# Altium project MainFileProject.PrjPcb
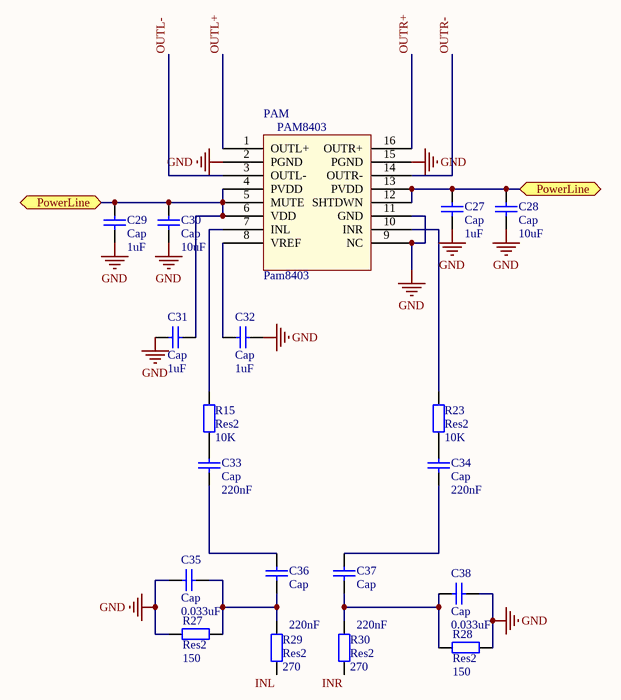
[diagram p0: Audio_Actual.SchDoc]
4 sheets, 123 parts. Net scope: flat (ports and power ports of the same name join across sheets).
Board file: DMG_Control_PanelV2.PcbDoc
Sheets:
  Audio_Actual.SchDoc
  ArduinoLeonard.SchDoc
  PowerBoost_Adafruit_based.SchDoc
  USBHUB.SchDoc

## Sheet Audio_Actual.SchDoc
size A4; PageSetup: Record=PageOptions|CenterHorizontal=True|CenterVertical=True|PrintScale=0.97|XCorrection=1.00|YCorrection=1.00|PrintKind=0|BorderSize=5000000|LeftOffset=0|BottomOffset=0|Orientation=2|PaperLength=1000|PaperWidth=1000|Scale=100|PaperSource=7|PrintQuality=-3|MediaType=1|DitherType=10|PrintScaleMode=1|PaperKind=A4|PaperIndex=9

### Parts
C27  Cap  value 1uF  [0805]
C28  Cap  value 10uF  [0805]
C29  Cap  value 1uF  [0805]
C30  Cap  value 10uF  [0805]
C31  Cap  value 1uF  [0805]
C32  Cap  value 1uF  [0805]
C33  Cap  value 220nF  [0805]
C34  Cap  value 220nF  [0805]
C35  Cap  value 0.033uF  [0805]
C36  Cap  value 220nF  [RES-1206in]
C37  Cap  value 220nF  [RES-1206in]
C38  Cap  value 0.033uF  [0805]
PAM  Pam8403  [pam8403 Sop16]
R15  Res2  value 10K  [0805]
R23  Res2  value 10K  [0805]
R27  Res2  value 150  [0805]
R28  Res2  value 150  [0805]
R29  Res2  value 270  [0805]
R30  Res2  value 270  [0805]

### Ports
PowerLine

### Nets
GND: C27.2 C28.1 C29.2 C30.1 C31.1 C32.2 C35.2 C38.1 PAM.2(PGND) PAM.9(NC) PAM.11(GND) PAM.15(PGND) R27.2 R28.1
INL: R29.1
INR: R30.1
OUTL+: PAM.1(OUTL+)
OUTL-: PAM.3(OUTL-)
OUTR+: PAM.16(OUTR+)
OUTR-: PAM.14(OUTR-)
Net5V_2: C27.1 C28.2 C29.1 C30.2 C31.2 PAM.4(PVDD) PAM.5(MUTE) PAM.6(VDD) PAM.12(SHTDWN) PAM.13(PVDD) ; port PowerLine
NetC32_1: C32.1 PAM.8(VREF)
NetC33_1: C33.1 C36.2
NetC33_2: C33.2 R15.1
NetC34_1: C34.1 C37.2
NetC34_2: C34.2 R23.1
NetC35_1: C35.1 C36.1 R27.1 R29.2
NetC37_1: C37.1 C38.2 R28.2 R30.2
NetPAM_7: PAM.7(INL) R15.2
NetPAM_10: PAM.10(INR) R23.2

### Notes on the sheet
- (in symbol Pam8403) PAM8403

### Library data of the parts
C27-C38 = Cap: Capacitor; Published: 8-Jun-2000; LatestRevisionDate: 17-Jul-2002; LatestRevisionNote: Re-released for DXP Platform.; PackageReference: RAD-0.3; Publisher: Altium Limited; PackageDescription: Radial Cap, Thru-Hole; 2 Leads; 0.3 in Pin Spacing
R15 R23 R27-R30 = Res2: Resistor; Published: 8-Jun-2000; LatestRevisionDate: 17-Jul-2002; LatestRevisionNote: Re-released for DXP Platform.; PackageReference: AXIAL-0.4; Publisher: Altium Limited; PackageDescription: Axial Device, Thru-Hole; 2 Leads; 0.4 in Pin Spacing

## Sheet ArduinoLeonard.SchDoc
size A4; PageSetup: Record=PageOptions|CenterHorizontal=True|CenterVertical=True|PrintScale=0.97|XCorrection=1.00|YCorrection=1.00|PrintKind=0|BorderSize=5000000|LeftOffset=0|BottomOffset=0|Orientation=2|PaperLength=1000|PaperWidth=1000|Scale=100|PaperSource=278|PrintQuality=-3|MediaType=1|DitherType=10|PrintScaleMode=1|PaperKind=A4|PaperIndex=9
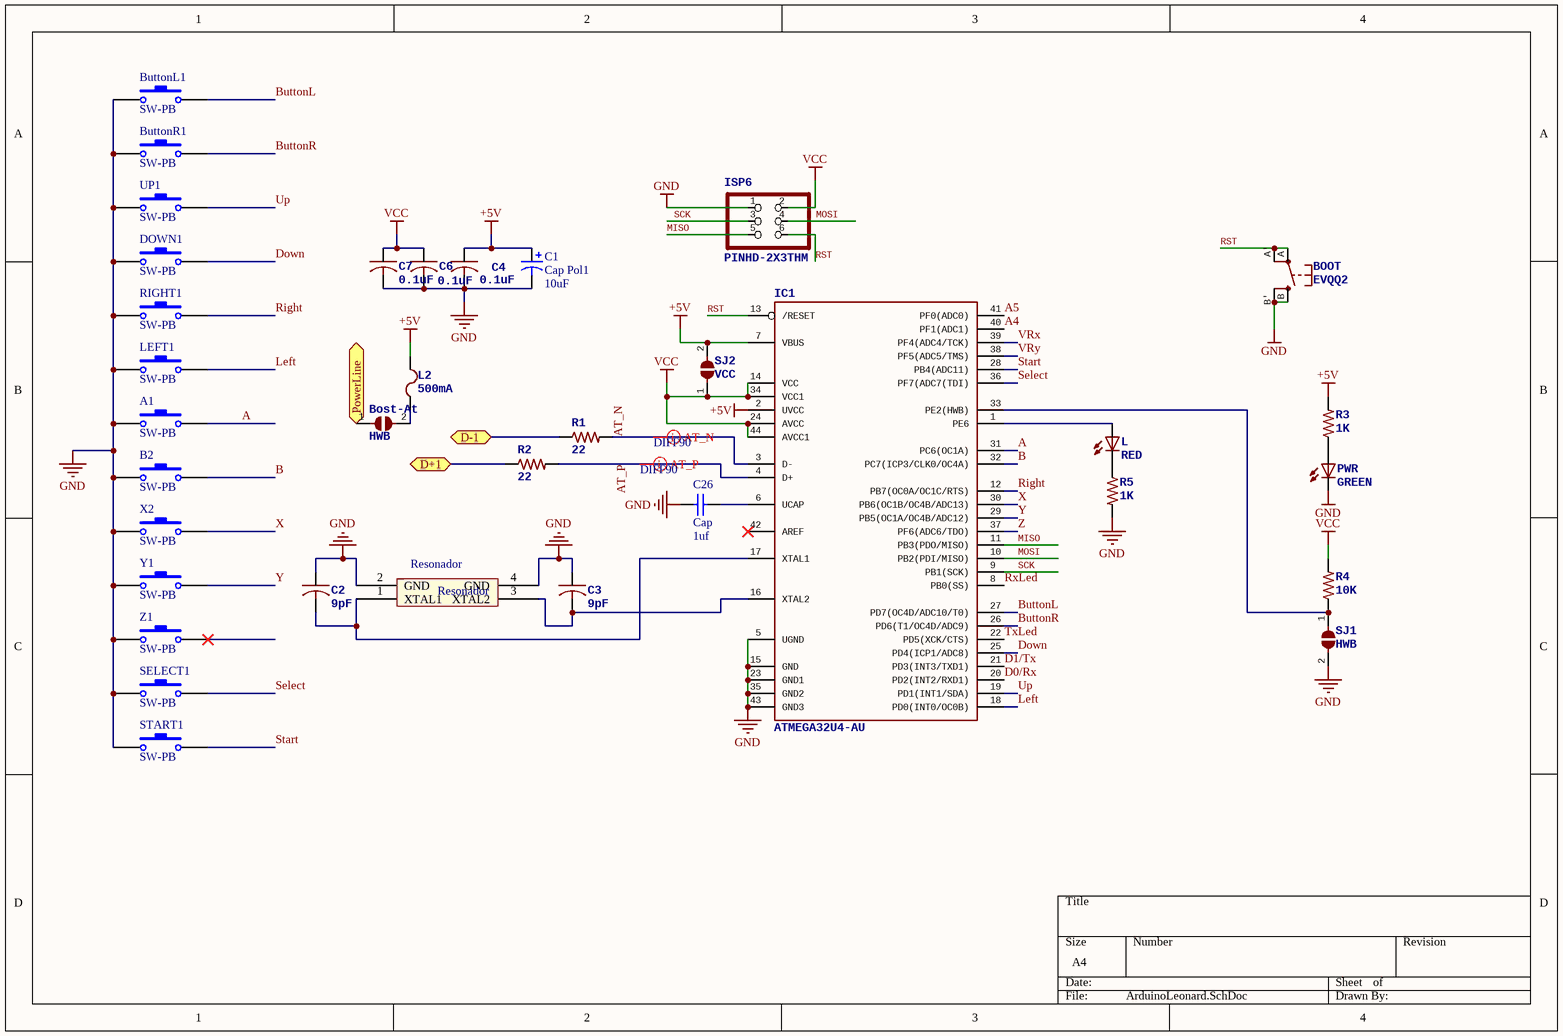
[diagram p1: ArduinoLeonard.SchDoc]

### Parts
A1  SW-PB  [DMG-BTN]
B2  SW-PB  [DMG-BTN]
BOOT  EVQQ2  [EVQ-Q2]
Bost-At  HWB  [JUMPER]
ButtonL1  SW-PB  [1X02_OVAL]
ButtonR1  SW-PB  [1X02_OVAL]
C1  Cap Pol1  value 10uF  [RES-1206in]
C2  9pF  [1608[0603]]
C3  9pF  [1608[0603]]
C4  0.1uF  [1608[0603]]
C6  0.1uF  [1608[0603]]
C7  0.1uF  [1608[0603]]
C26  Cap  value 1uf  [0805]
DOWN1  SW-PB  [DMG-BTN]
IC1  ATMEGA32U4-AU  [TQFP44]
ISP6  PINHD-2X3THM  [1X06_OVAL]
L  RED  [CHIPLED_0805]
L2  500mA  [RES-1206in]
LEFT1  SW-PB  [DMG-BTN]
PWR  GREEN  [CHIPLED_0805]
R1  22  [0603]
R2  22  [0603]
R3  1K  [RES-1206in]
R4  10K  [RES-1206in]
R5  1K  [RES-1206in]
RIGHT1  SW-PB  [DMG-BTN]
SELECT1  SW-PB  [DMG-SEL]
SJ1  HWB  [JUMPER]
SJ2  VCC  [JUMPER]
START1  SW-PB  [DMG-ST]
UP1  SW-PB  [DMG-BTN]
X2  SW-PB  [DMG-BTN -XY]
X4  SMD-CRYSTAL-16MHZ-9PF-Resonador  [Resonador3.2x2.5]  (value not drawn)
Y1  SW-PB  [DMG-BTN -XY]
Z1  SW-PB  [DMG-BTN -XY]

### Ports
D+1, D-1, PowerLine

### Nets
+5V: C1.1 C4.1 IC1.2(UVCC) IC1.7(VBUS) L2.2 R3.2 SJ2.2
GND: A1.1 B2.1 BOOT.B(S) BOOT.B'(S1) ButtonL1.1 ButtonR1.1 C1.2 C2.1 C3.1 C4.2 C6.2 C7.2 C26.1 DOWN1.1 IC1.5(UGND) IC1.15(GND) IC1.23(GND1) IC1.35(GND2) IC1.43(GND3) ISP6.1 LEFT1.1 PWR.C R5.2 RIGHT1.1 SELECT1.1 SJ1.2 START1.1 UP1.1 X2.1 X4.2(GND) X4.4(GND) Y1.1 Z1.1
VCC: C6.1 C7.1 IC1.14(VCC) IC1.24(AVCC) IC1.34(VCC1) IC1.44(AVCC1) ISP6.2 R4.2 SJ2.1
A: A1.2 IC1.31(PC6(OC1A))
A4: IC1.40(PF1(ADC1))
A5: IC1.41(PF0(ADC0))
AT_N: IC1.3(D-) R1.2
AT_P: IC1.4(D+) R2.2
B: B2.2 IC1.32(PC7(ICP3/CLK0/OC4A))
ButtonL: ButtonL1.2 IC1.27(PD7(OC4D/ADC10/T0))
ButtonR: ButtonR1.2 IC1.26(PD6(T1/OC4D/ADC9))
D0/Rx: IC1.20(PD2(INT2/RXD1))
D1/Tx: IC1.21(PD3(INT3/TXD1))
Down: DOWN1.2 IC1.25(PD4(ICP1/ADC8))
Left: IC1.18(PD0(INT0/OC0B)) LEFT1.2
MISO: IC1.11(PB3(PDO/MISO)) ISP6.5
MOSI: IC1.10(PB2(PDI/MISO)) ISP6.4
Right: IC1.12(PB7(OC0A/OC1C/RTS)) RIGHT1.2
RST: BOOT.A(P) BOOT.A'(P1) IC1.13(/RESET) ISP6.6
RxLed: IC1.8(PB0(SS))
SCK: IC1.9(PB1(SCK)) ISP6.3
Select: IC1.36(PF7(ADC7(TDI)) SELECT1.2
Start: IC1.28(PB4(ADC11)) START1.2
TxLed: IC1.22(PD5(XCK/CTS))
Up: IC1.19(PD1(INT1/SDA)) UP1.2
USB1_N: R1.1 ; port D-1
USB1_P: R2.1 ; port D+1
VRx: IC1.39(PF4(ADC4/TCK))
VRy: IC1.38(PF5(ADC5/TMS))
X: IC1.30(PB6(OC1B/OC4B/ADC13)) X2.2
Y: IC1.29(PB5(OC1A/OC4B/ADC12)) Y1.2
Z: IC1.37(PF6(ADC6/TDO))
Net5V_2: Bost-At.1 ; port PowerLine
NetBost-At_2: Bost-At.2 L2.1
NetC2_2: C2.2 IC1.17(XTAL1) X4.1(XTAL1)
NetC3_2: C3.2 IC1.16(XTAL2) X4.3(XTAL2)
NetC26_2: C26.2 IC1.6(UCAP)
NetIC1_1: IC1.1(PE6) L.A
NetIC1_33: IC1.33(PE2(HWB)) R4.1 SJ1.1
NetL_C: L.C R5.1
NetPWR_A: PWR.A R3.1

Not connected (* = marked no-connect by the designer): IC1 42(AREF)*; Z1 2*

### Layout directives
differential pair; net class DIFF90: AT_N, AT_P

### Notes on the sheet
- (in symbol SMD-CRYSTAL-16MHZ-9PF-10PPM-60R(4P-3.2X2.5MM)) Resonador

### Library data of the parts
A1 B2 ButtonL1 ButtonR1 DOWN1 LEFT1 RIGHT1 SELECT1 START1 UP1 X2 Y1 Z1 = SW-PB: Switch; Published: 24-Mar-1999; LatestRevisionDate: 17-Jul-2002; LatestRevisionNote: Re-released for DXP Platform.; PackageReference: SPST-2; Publisher: Altium Limited; PackageDescription: Switch; 2 Leads
Bost-At SJ1 SJ2 = SJ: SMD solder JUMPER
C1 = Cap Pol1: Polarized Capacitor (Radial); Published: 8-Jun-2000; LatestRevisionDate: 17-Jul-2002; LatestRevisionNote: Re-released for DXP Platform.; PackageReference: RB7.6-15; Publisher: Altium Limited; PackageDescription: Polarized Capacitor (Radial); 2 Leads
C2-C4 C6 C7 = C-USC0805K: CAPACITOR, American symbol
C26 = Cap: Capacitor; Published: 8-Jun-2000; LatestRevisionDate: 17-Jul-2002; LatestRevisionNote: Re-released for DXP Platform.; PackageReference: RAD-0.3; Publisher: Altium Limited; PackageDescription: Radial Cap, Thru-Hole; 2 Leads; 0.3 in Pin Spacing
L PWR = LEDCHIPLED_0805: LED   OSRAM: - CHIPLED LG R971, LG N971, LY N971, LG Q971, LY Q971, LO R971, LY R971 LH N974, LH R974 LS Q976, LO Q976, LY Q976 LO Q996 - Hyper CHIPLED LW Q18S LB Q993, LB Q99A, LB R99A - SideLED LS A670, LO A670, LY A670, LG A670, LP A670 LB A673, LV A673, LT A673, LW A673 LH A674 LY A675 LS A676, LA A676, LO A676, LY A676, LW A676 LS A679, LY A679, LG A679 -  Hyper Micro SIDELED® LS Y876, LA Y876, LO Y876, LY Y876 LT Y87S - SmartLED LW L88C, LW L88S LB L89C, LB L89S, LG L890 LS L89K, LO L89K, LY L89K LS L896, LA L896, LO L896, LY L896 - TOPLED LS T670, LO T670, LY T670, LG T670, LP T670 LSG T670, LSP T670, LSY T670, LOP T670, LYG T670 LG T671, LOG T671, LSG T671 LB T673, LV T673, LT T673, LW T673 LH T674 LS T676, LA T676, LO T676, LY T676, LB T676, LH T676, LSB T676, LW T676 LB T67C, LV T67C, LT T67C, LS T67K, LO T67K, LY T67K, LW E67C LS E67B, LA E67B, LO E67B, LY E67B, LB E67C, LV E67C, LT E67C LW T67C LS T679, LY T679, LG T679 LS T770, LO T770, LY T770, LG T770, LP T770 LB T773, LV T773, LT T773, LW T773 LH T774 LS E675, LA E675, LY E675, LS T675 LS T776, LA T776, LO T776, LY T776, LB T776 LHGB T686 LT T68C, LB T68C - Hyper Mini TOPLED® LB M676 - Mini TOPLED Santana® LG M470 LS M47K, LO M47K, LY M47K    Source: http://www.osram.convergy.de/
L2 = PTCFUSE-1206: PTC fuses, resettable thermistors
R1-R5 = R-US_R0805: RESISTOR, American symbol
X4 = SMD-CRYSTAL-16MHZ-9PF-10PPM-60R(4P-3.2X2.5MM): SMD Crystal 16MHz-9pF-10ppm-60R;; MF: Epson; MP: TSX-3225 16.0000MF18X-AC3; Package: 1210 Epson; Price: 0.38 USD; Availability: Bad; Value: *

## Sheet PowerBoost_Adafruit_based.SchDoc
size A4; PageSetup: Record=PageOptions|CenterHorizontal=True|CenterVertical=True|PrintScale=0.97|XCorrection=1.00|YCorrection=1.00|PrintKind=0|BorderSize=5000000|LeftOffset=0|BottomOffset=0|Orientation=2|PaperLength=1000|PaperWidth=1000|Scale=100|PaperSource=7|PrintQuality=-3|MediaType=1|DitherType=10|PrintScaleMode=1|PaperKind=A4|PaperIndex=9
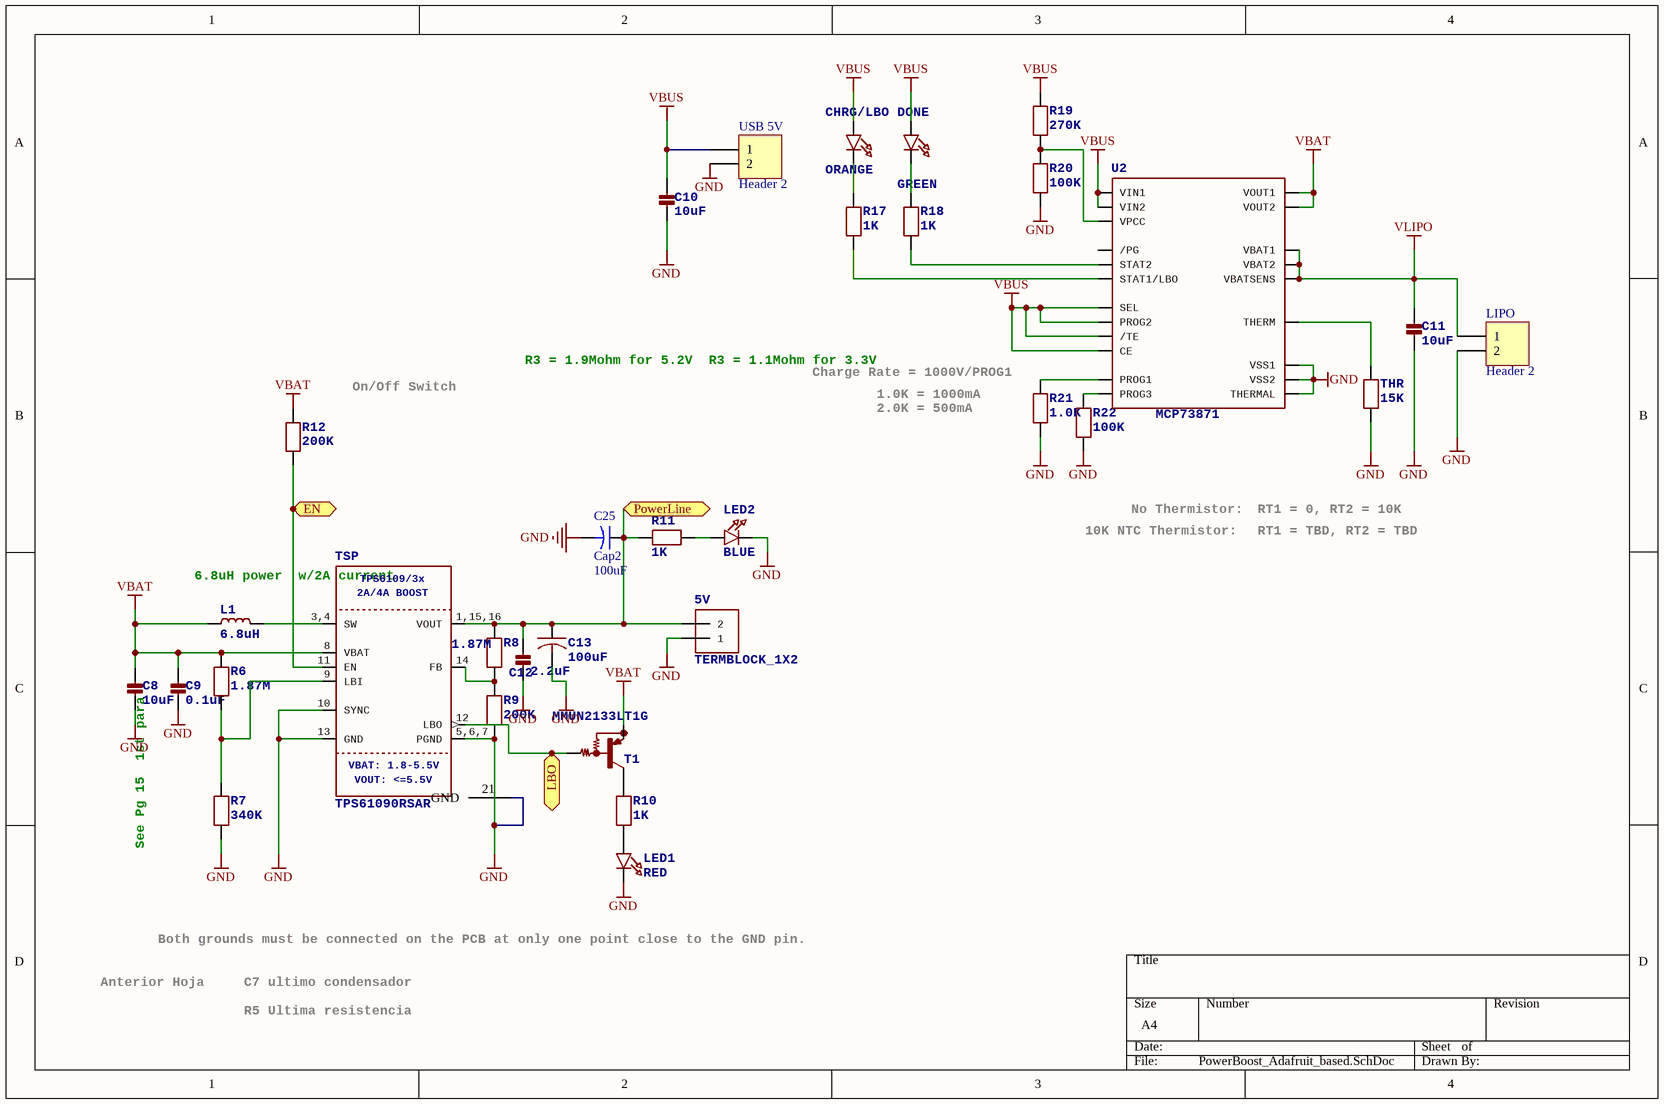
[diagram p2: PowerBoost_Adafruit_based.SchDoc]

### Parts
5V  TERMBLOCK_1X2  [TERMBLOCK_1X2-3.5MM]
C8  10uF  [1608[0603]]
C9  0.1uF  [1608[0603]]
C10  10uF  [RES-1206in]
C11  10uF  [RES-1206in]
C12  2.2uF  [RES-0805]
C13  100uF  [RES-1206in]
C25  Cap2  value 100uF  [RES-1206in]
CHRG/LBO  ORANGE  [RES-0805]
DONE  GREEN  [RES-0805]
L1  6.8uH  [INDUCTOR_5X5MM_TDK_VLC5045]
LED1  RED  [RES-0805]
LED2  BLUE  [RES-0805]
LIPO  Header 2  [HDR1X2]
R6  1.87M  [RES-1206in]
R7  340K  [RES-1206in]
R8  1.87M  [RES-1206in]
R9  200K  [RES-1206in]
R10  1K  [RES-1206in]
R11  1K  [RES-1206in]
R12  200K  [RES-1206in]
R17  1K  [RES-1206in]
R18  1K  [RES-1206in]
R19  270K  [RES-1206in]
R20  100K  [RES-1206in]
R21  1.0K  [RES-1206in]
R22  100K  [RES-1206in]
T1  MMUN2133LT1G  [MMUN2133LT1G]
THR  15K  [Res-0603]
TSP  TPS61090RSAR  2A/4ABOOST: 2A/4A BOOST  VBAT:1.8-5.5V: VBAT: 1.8-5.5V  VOUT:<=5.5V: VOUT: <=5.5V  [QFN65P400X400X100-17N]
U2  MCP73871  [QFN50P400X400X100-21N]
USB_5V  Header 2  [HDR1X2]

### Ports
EN, LBO, PowerLine

### Nets
GND: 5V.1 C8.2 C9.2 C10.2 C11.2 C12.2 C13.2 C25.2 LED1.2(C) LED2.2 LIPO.2 R7.1 R9.1 R20.2 R21.1 R22.1 THR.1 TSP.5,6,7(PGND) TSP.10(SYNC) TSP.13(GND) TSP.21(GND) U2.10(VSS1) U2.11(VSS2) U2.21(THERMAL) USB_5V.2
VBAT: C8.1 C9.1 L1.1 R6.2 R12.1 T1.2(E) TSP.8(VBAT) U2.1(VOUT1) U2.20(VOUT2)
VBUS: C10.1 CHRG/LBO.1(A) DONE.1(A) R19.2 U2.3(SEL) U2.4(PROG2) U2.9(/TE) U2.17(CE) U2.18(VIN1) U2.19(VIN2) USB_5V.1
VLIPO: C11.1 LIPO.1 U2.14(VBAT1) U2.15(VBAT2) U2.16(VBATSENS)
Net5V_2: 5V.2 C12.1 C13.1 C25.1 R8.2 R11.1 TSP.1,15,16(VOUT) ; port PowerLine
NetCHRG/LBO_2: CHRG/LBO.2(C) R17.2
NetDONE_2: DONE.2(C) R18.2
NetL1_2: L1.2 TSP.3,4(SW)
NetLED1_1: LED1.1(A) R10.1
NetLED2_1: LED2.1(A) R11.2
NetR6_1: R6.1 R7.2 TSP.9(LBI)
NetR8_1: R8.1 R9.2 TSP.14(FB)
NetR10_2: R10.2 T1.3(C)
NetR12_2: R12.2 TSP.11(EN) ; port EN
NetR17_1: R17.1 U2.8(STAT1/LBO)
NetR18_1: R18.1 U2.7(STAT2)
NetR19_1: R19.1 R20.1 U2.2(VPCC)
NetR21_2: R21.2 U2.13(PROG1)
NetR22_2: R22.2 U2.12(PROG3)
NetS-R2_1: T1.1(B) TSP.12(LBO) ; port LBO
NetTHR_2: THR.2 U2.5(THERM)

Not connected (* = marked no-connect by the designer): U2 6(/PG)

### Notes on the sheet
- On/Off Switch
- R3 = 1.9Mohm for 5.2V
  R3 = 1.1Mohm for 3.3V
- Charge Rate = 1000V/PROG1
- 1.0K = 1000mA
- 2.0K = 500mA
- 10K NTC Thermistor:
- No Thermistor:
- RT1 = 0, RT2 = 10K
- RT1 = TBD, RT2 = TBD
- 6.8uH power
  w/2A current
- See Pg 15
  1st para
- Both grounds must be connected on the PCB at only one point close to the GND pin.
- Anterior Hoja
- C7 ultimo condensador
- R5 Ultima resistencia

### Library data of the parts
5V = TERMBLOCK_1X2: 3.5mm Terminal block    http://www.ladyada.net/library/pcb/eaglelibrary.html; COMPANY: ADAFRUIT INDUSTRIES; DRAWN: KTOWN; REV: A
C8 C10-C12 = CAP_CERAMIC0805-NOOUTLINE: Ceramic Capacitors   For new designs, use the packages preceded by an '_' character since they are more reliable:   The following footprints should be used on most boards: _0402 - Standard footprint for regular board layouts  _0603 - Standard footprint for regular board layouts  _0805 - Standard footprint for regular board layouts  _1206 - Standard footprint for regular board layouts       For extremely tight-pitch boards where space is at a premium, the following 'micro-pitch' footprints can be used (smaller pads, no silkscreen outline, etc.): _0402MP - Micro-pitch footprint for very dense/compact boards  _0603MP - Micro-pitch footprint for very dense/compact boards  _0805MP - Micro-pitch footprint for very dense/compact boards  _1206MP - Micro-pitch footprint for very dense/compact boards; COMPANY: ADAFRUIT INDUSTRIES; DRAWN: KTOWN; REV: A
C9 = CAP_CERAMIC0805_10MGAP: Ceramic Capacitors   For new designs, use the packages preceded by an '_' character since they are more reliable:   The following footprints should be used on most boards: _0402 - Standard footprint for regular board layouts  _0603 - Standard footprint for regular board layouts  _0805 - Standard footprint for regular board layouts  _1206 - Standard footprint for regular board layouts       For extremely tight-pitch boards where space is at a premium, the following 'micro-pitch' footprints can be used (smaller pads, no silkscreen outline, etc.): _0402MP - Micro-pitch footprint for very dense/compact boards  _0603MP - Micro-pitch footprint for very dense/compact boards  _0805MP - Micro-pitch footprint for very dense/compact boards  _1206MP - Micro-pitch footprint for very dense/compact boards; COMPANY: ADAFRUIT INDUSTRIES; DRAWN: KTOWN; REV: A
C13 = C-USC1210: CAPACITOR, American symbol; COMPANY: ADAFRUIT INDUSTRIES; DRAWN: KTOWN; REV: A
C25 = Cap2: Capacitor; Published: 23-Sep-2002; PackageReference: CAPR5-4X5; Publisher: Altium Limited; PackageDescription: Capacitor; 2 Leads
CHRG/LBO DONE LED1 LED2 = LED0805_NOOUTLINE: LED0603 - 0603 Surface Mount Package    2mA: Green LED - Low Power (3.9mcd, 2ma, 1.7Vf) - Digikey: 475-2709-2-ND  Orange LED - Low Power (9.8mcd, 2ma, 1.8Vf) - Digikey: 475-1194-2-ND  Red LED - Low Power (5mcd, 2ma, 1.8Vf) - Digikey: 475-1195-2-ND  Yellow LED - Low Power (7mcd, 2ma, 1.8Vf) - Digikey: 475-1196-2-ND       5mA: Blue LED - Low Power (17mcd, 5ma, 2.9Vf) - Digikey: LNJ937W8CRACT-ND    0805 - 0805 Surface Mount Package    2mA: Red LED (8.8mcd, 2mA, 1.8Vf, Clear) - Low Power [Digikey: 475-2510-1-ND]  Green LED (5mcd, 2mA, 1.8Vf, Clear) - Low Power [Digikey: 475-2730-1-ND]  Yellow LED (11.3mcd, 2mA, 1.8Vf, Clear) - Low Power [Digikey: 475-2555-1-ND]       20mA: Red LED (104mcd, 20mA, Diffused) - LS R976 [Digikey: 475-1278-6-ND]  Red LED (12mcd, 20mA, 2.0Vf, Clear) - APT2012EC [Digikey: 754-1128-1-ND]  Green LED (15mcd, 20mA, 2.2Vf, Clear) - APT2012GC [Digikey: 754-1131-1-ND]  Orange LED (160mcd, 20mA, 2.1Vf, Clear) - APT2012SECK [Digikey: 754-1130-1-ND]     1206 - 1206 Surface Mount Package  Green LED (26mcd, 20mA, Diffused) - LG N971  [Digikey: 475-1407-6-ND]  Red LED (15mcd, 20mA, Diffused) - LH N974 [Digikey: 475-1416-6-ND]     Cree - Cree High-Power Surface Mount LEDs  XPEBWT-L1-0000-00D50 - White 111lm 350mA 2.9Vf 6200K 110°  XTEAWT-00-0000-00000LEE3 - White 114lm 350mA 2.85Vf 5000K 115°     Everlight - Everlight 45-21 Series Surface Mount LEDs  45-21/QK2C-B2832AC2CB2/2T - Warm White 2000mcd 20mA 3.25Vf 3050K 120°  45-21/LK2C-B38452C4CB2/2T - Nuetral White 2000mcd 20mA 3.25Vf 4150K 120°  45-21/LK2C-B50634C6CB2/2T - Cold White 2200mcd 20mA 3.25Vf 5650K 120°     PLCC2 Reverse Mount LS T77K-J1L2-1-0-2-R18-Z - Red 11.25mcd 2mA 1.8Vf 630nm 120°  LO T77K-L1M2-24-Z - Orange 19.6mcd 2mA 1.8Vf 606nm 120°  LY T77K-K2M1-26-Z - Yellow 15.7mcd 2mA 1.8Vf 587nm 120°; COMPANY: ADAFRUIT INDUSTRIES; DRAWN: KTOWN; REV: A
L1 = INDUCTORTDK_VLC5045: Inductors   0603: 10nH Ceramic Inductor - microwire antenna/RF (Digikey: 712-1434-2-ND)       0805: 560nH Ceramic Inductor - RF (Digikey: 553-1047-1-ND)  270nH Ceramic Inductor - Q = 40@250MHz, +-5%, 1 Ohm DC Resistance (Digikey: 535-10506-2-ND)       1007 (2518 Metric) SMT: 10µH 10% 250mOhm 820mA 1007 Inductor (Digikey: 587-2189-1-ND)  22µH 10% 500mOhm 580mA 1007 Inductor (Digikey: 587-2190-1-ND)  47µH 10% 950mOhm 420mA 1007 Inductor (Digikey: 587-2191-1-ND)  47µH 5% 100mOhm 1A 1008 Inductor (Digikey: 732-1816-1-ND)       5.0x5.0mm (Taiyo Yuden NR5040 Series) 6.8µH 20% 2.3A 64mOhm Inductor (Digikey: 587-2374-2-ND)       5.0x5.0mm (TDK VLC5045 Series) 4.7µH 20% 3.3A 34mOhm Inductor (Digikey: 445-6526-1-ND)  6.8µH 20% 2.7A 46mOhm Inductor (Digikey: 445-6527-1-ND)       6.0x6.0mm (TDK VLC6045 Series) 4.7µH 20% 3.8A 27mOhm Inductor (Digikey: 445-6538-2-ND)  6.8µH 20% 3A 41mOhm Inductor (Digikey: 445-6540-1-ND)  6.2µH 30% 2.2A 45mOhm Inductor (Digikey: SRR5028-6R2YCT-ND) - Not TDK VLC6045 but footprint should match       6.0x6.0mm (TDK SLF6045 Series) 6.8uH 30% 2A 33mOhm Inductor (Digikey: 445-4572-1-ND, Mouser: 810-SLF645T6R8N2R0PF)       6.0x6.0mm (Sumida CDRH5D28 Series) 6.2uH 30% 1.8A 45mOhm Inductor (Digikey: 308-1542-1-ND)       Taiyo Yuden NR3015T2R2M - 2.2uH 20% 1.5A (Digikey: 587-1648-2-ND, Mouser: 963-NR3015T2R2M) - Used with TI TPS62172   CoilCraft RFID Transponder Coil - MA5532-AE (For use with AS3935 Lightning Sensor)   Vishay IHLP  1.0uH Molded Inductor - 24mOhm DCR, 5A, +/-20%, -55°C-125°C (Digikey: 541-1319-1-ND); COMPANY: ADAFRUIT INDUSTRIES; DRAWN: KTOWN; REV: A
LIPO USB_5V = Header 2: Header, 2-Pin; LatestRevisionDate: 17-Jul-2002; LatestRevisionNote: Re-released for DXP Platform.; Publisher: Altium Limited
R6 R7 = RESISTOR_0805MP: Resistors   For new designs, use the packages preceded by an '_' character since they are more reliable:   The following footprints should be used on most boards: _0402 - Standard footprint for regular board layouts  _0603 - Standard footprint for regular board layouts  _0805 - Standard footprint for regular board layouts  _1206 - Standard footprint for regular board layouts       For extremely tight-pitch boards where space is at a premium, the following 'micro-pitch' footprints can be used (smaller pads, no silkscreen outline, etc.): _0402MP - Micro-pitch footprint for very dense/compact boards  _0603MP - Micro-pitch footprint for very dense/compact boards  _0805MP - Micro-pitch footprint for very dense/compact boards  _1206MP - Micro-pitch footprint for very dense/compact boards; COMPANY: ADAFRUIT INDUSTRIES; DRAWN: KTOWN; REV: A
R8-R12 R17-R22 THR = RESISTOR0805_NOOUTLINE: Resistors   For new designs, use the packages preceded by an '_' character since they are more reliable:   The following footprints should be used on most boards: _0402 - Standard footprint for regular board layouts  _0603 - Standard footprint for regular board layouts  _0805 - Standard footprint for regular board layouts  _1206 - Standard footprint for regular board layouts       For extremely tight-pitch boards where space is at a premium, the following 'micro-pitch' footprints can be used (smaller pads, no silkscreen outline, etc.): _0402MP - Micro-pitch footprint for very dense/compact boards  _0603MP - Micro-pitch footprint for very dense/compact boards  _0805MP - Micro-pitch footprint for very dense/compact boards  _1206MP - Micro-pitch footprint for very dense/compact boards; COMPANY: ADAFRUIT INDUSTRIES; DRAWN: KTOWN; REV: A
T1 = *-PNP_DRIVER-SC59-BEC: PNP Bias Resistor Transistor
TSP = VREG_TPS6103X: TPS6103x 4A Boost - 1.8-5.5V Input, Adjustable Output to 5.5V; COMPANY: ADAFRUIT INDUSTRIES; DRAWN: KTOWN; REV: A; TPS6109/3x: TPS6109/3x
U2 = MCP73871: MCP73871 Lithium Polymer Battery Charger   Digikey: MCP73871-2CCI/ML-ND; COMPANY: ADAFRUIT INDUSTRIES; DRAWN: KTOWN; REV: A

## Sheet USBHUB.SchDoc
size A4; PageSetup: Record=PageOptions|CenterHorizontal=True|CenterVertical=True|PrintScale=0.97|XCorrection=1.00|YCorrection=1.00|PrintKind=0|BorderSize=5000000|LeftOffset=0|BottomOffset=0|Orientation=2|PaperLength=1000|PaperWidth=1000|Scale=100|PaperSource=7|PrintQuality=-3|MediaType=1|DitherType=10|PrintScaleMode=1|PaperKind=A4|PaperIndex=9
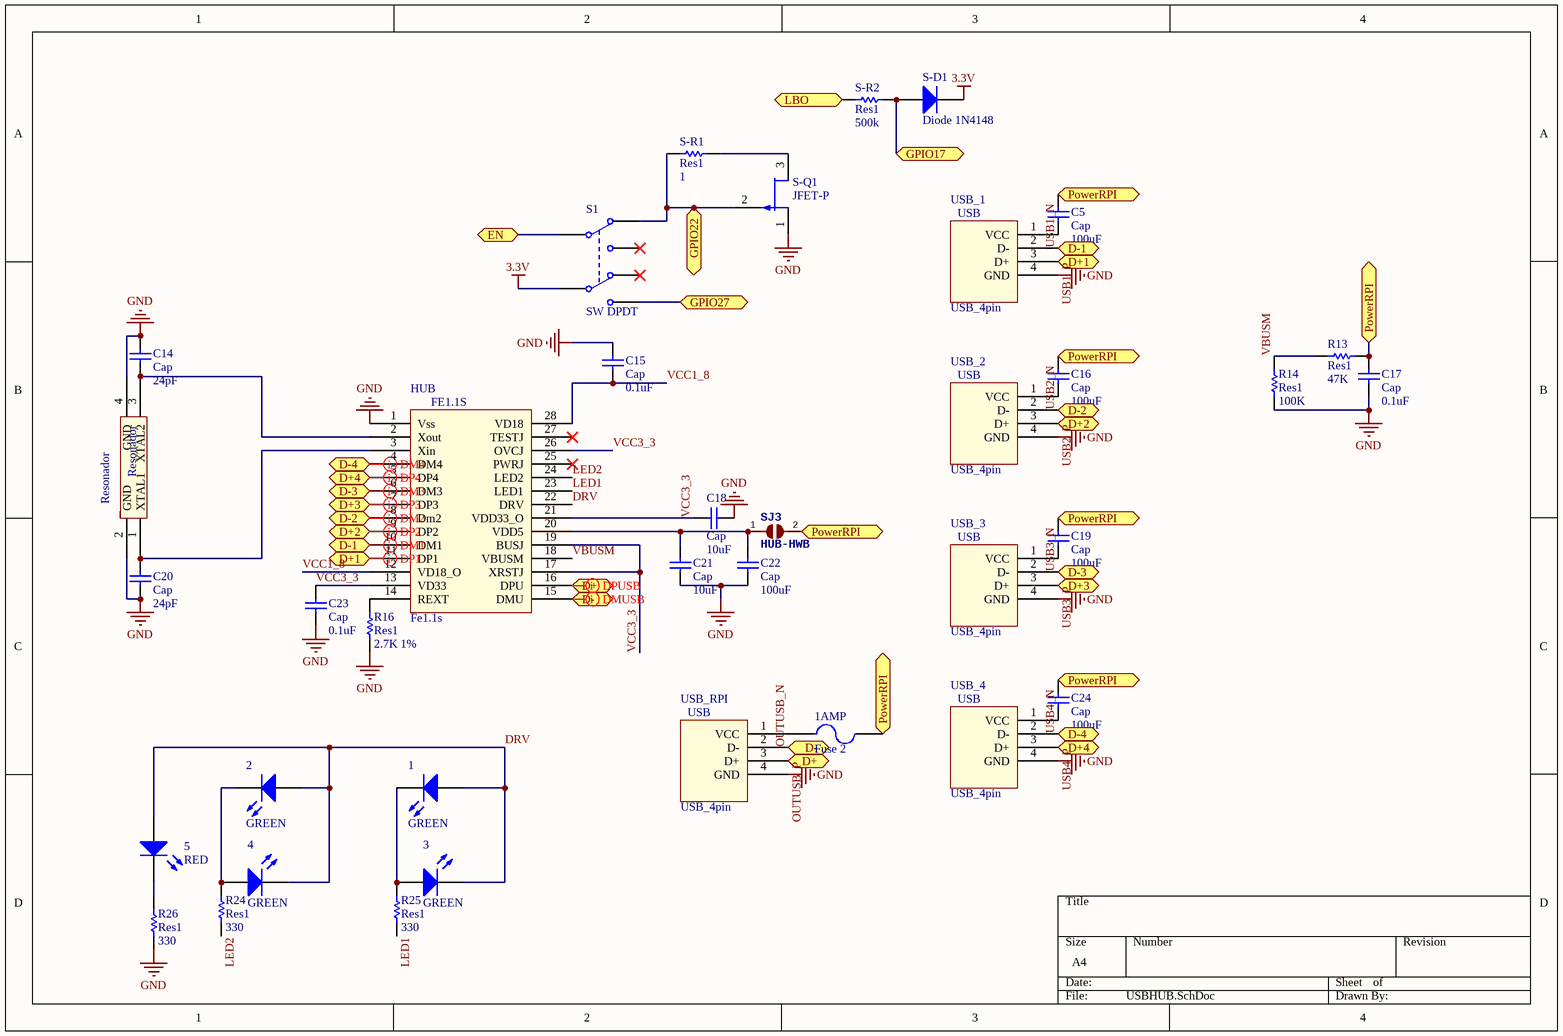
[diagram p3: USBHUB.SchDoc]

### Parts
1  GREEN  [0805]
1AMP  Fuse 2  [0603]
2  GREEN  [0805]
3  GREEN  [0805]
4  GREEN  [0805]
5  RED  [0805]
C5  Cap  value 100uF  [1206]
C14  Cap  value 24pF  [0603]
C15  Cap  value 0.1uF  [0603]
C16  Cap  value 100uF  [1206]
C17  Cap  value 0.1uF  [0603]
C18  Cap  value 10uF  [1206]
C19  Cap  value 100uF  [1206]
C20  Cap  value 24pF  [0603]
C21  Cap  value 10uF  [1206]
C22  Cap  value 100uF  [1206]
C23  Cap  value 0.1uF  [0603]
C24  Cap  value 100uF  [1206]
HUB  Fe1.1s  [fe1.1s]
R13  Res1  value 47K  [1206]
R14  Res1  value 100K  [1206]
R16  Res1  value 2.7K 1%  [1206]
R24  Res1  value 330  [1206]
R25  Res1  value 330  [1206]
R26  Res1  value 330  [1206]
S1  SW DPDT  [Switch]
S-D1  Diode 1N4148  [D1n4148]
S-Q1  JFET-P  [SOT-23 TO236]
S-R1  Res1  value 1  [1206]
S-R2  Res1  value 500k  [1206]
SJ3  HUB-HWB  [JUMPER]
USB_1  USB_4pin  [USBPADS]
USB_2  USB_4pin  [USBPADS]
USB_3  USB_4pin  [USBPADS]
USB_4  USB_4pin  [USBPADS]
USB_RPI  USB_4pin  [USBPADS]
X5  SMD-CRYSTAL-16MHZ-9PF-Resonador  [Res12MHZ-smd]  (value not drawn)

### Ports
D+, D+1, D+2, D+3, D+4, D-, D-1, D-2, D-3, D-4, EN, GPIO17, GPIO22, GPIO27, LBO, PowerRPI

### Nets
3.3V: S1.5(COMMON2) S-D1.2(K)
GND: C14.2 C15.2 C17.1 C18.2 C20.1 C21.1 C22.1 C23.1 HUB.1(Vss) R14.1 R16.1 R26.1 S-Q1.1(D) USB_1.4(GND) USB_2.4(GND) USB_3.4(GND) USB_4.4(GND) USB_RPI.4(GND) X5.2(GND) X5.4(GND)
DRV: 1.1(A) 2.1(A) 3.2(K) 4.2(K) 5.1(A) HUB.22(DRV)
LED1: HUB.23(LED1) R25.1
LED2: HUB.24(LED2) R24.1
OUTUSB_N: HUB.15(DMU) USB_RPI.2(D-) ; port D-
OUTUSB_P: HUB.16(DPU) USB_RPI.3(D+) ; port D+
USB1_N: HUB.10(DM1) USB_1.2(D-) ; port D-1
USB1_P: HUB.11(DP1) USB_1.3(D+) ; port D+1
USB2_N: HUB.8(Dm2) USB_2.2(D-) ; port D-2
USB2_P: HUB.9(DP2) USB_2.3(D+) ; port D+2
USB3_N: HUB.6(DM3) USB_3.2(D-) ; port D-3
USB3_P: HUB.7(DP3) USB_3.3(D+) ; port D+3
USB4_N: HUB.4(DM4) USB_4.2(D-) ; port D-4
USB4_P: HUB.5(DP4) USB_4.3(D+) ; port D+4
VBUSM: HUB.18(VBUSM) R13.1 R14.2
VCC1_8: C15.2 HUB.12(VD18_O) HUB.28(VD18)
VCC3_3: C18.1 C23.2 HUB.13(VD33) HUB.17(XRSTJ) HUB.19(BUSJ) HUB.21(VDD33_O) HUB.26(OVCJ)
Net1_2: 1.2(K) 3.1(A) R25.2
Net1AMP_1: 1AMP.1 USB_RPI.1(VCC)
Net1AMP_2: 1AMP.2 C5.2 C16.2 C17.2 C19.2 C24.2 R13.2 SJ3.2 ; port PowerRPI
Net2_2: 2.2(K) 4.1(A) R24.2
Net5_2: 5.2(K) R26.2
NetC5_1: C5.1 USB_1.1(VCC)
NetC14_1: C14.1 HUB.2(Xout) X5.3(XTAL2)
NetC16_1: C16.1 USB_2.1(VCC)
NetC19_1: C19.1 USB_3.1(VCC)
NetC20_2: C20.2 HUB.3(Xin) X5.1(XTAL1)
NetC21_2: C21.2 C22.2 HUB.20(VDD5) SJ3.1
NetC24_1: C24.1 USB_4.1(VCC)
NetHUB_14: HUB.14(REXT) R16.2
NetR12_2: S1.1(COMMON1) ; port EN
NetS1_2: S1.2(NC1) S-Q1.2(G) S-R1.1 ; port GPIO22
NetS1_6: S1.6(NO2) ; port GPIO27
NetS-D1_1: S-D1.1(A) S-R2.2 ; port GPIO17
NetS-Q1_3: S-Q1.3(S) S-R1.2
NetS-R2_1: S-R2.1 ; port LBO

Not connected (* = marked no-connect by the designer): HUB 25(PWRJ)* 27(TESTJ)*; S1 3(NO1)* 4(NC2)*

### Layout directives
differential pair; net class DIFF90: OUTUSB_N, OUTUSB_P, USB1_N, USB1_P, USB2_N, USB2_P, USB3_N, USB3_P, USB4_N, USB4_P

### Notes on the sheet
- (in symbol Fe1.1s) FE1.1S
- (in symbol SMD-CRYSTAL-16MHZ-9PF-10PPM-60R(4P-3.2X2.5MM)) Resonador
- (in symbol USB_4pin) USB

### Library data of the parts
1-5 = LED3: Typical BLUE SiC LED; Published: 8-Jun-2000; LatestRevisionDate: 17-Dec-2003; LatestRevisionNote: PCB Footprint replaced.; DatasheetVersion: 16-Apr-2002; PackageVersion: 16-Apr-2002; PackageReference: 3.5X2.8X1.9; Publisher: Altium Limited; PackageDescription: SM LED; 2 C-Bend Leads; Body 3.5 x 2.8 x 1.9 mm, inc leads (LxWxH typ)
1AMP = Fuse 2: Fuse; Published: 8-Jun-2000; LatestRevisionDate: 17-Jul-2002; LatestRevisionNote: Re-released for DXP Platform.; PackageReference: PIN-W2/E2.8; Publisher: Altium Limited; PackageDescription: Thru-Hole; 2 Leads
C5 C14-C24 = Cap: Capacitor; Published: 8-Jun-2000; LatestRevisionDate: 17-Jul-2002; LatestRevisionNote: Re-released for DXP Platform.; PackageReference: RAD-0.3; Publisher: Altium Limited; PackageDescription: Radial Cap, Thru-Hole; 2 Leads; 0.3 in Pin Spacing
R13 R14 R16 R24-R26 S-R1 S-R2 = Res1: Resistor; Published: 8-Jun-2000; LatestRevisionDate: 17-Jul-2002; LatestRevisionNote: Re-released for DXP Platform.; PackageReference: AXIAL-0.3; Publisher: Altium Limited; PackageDescription: Axial Device, Thru-Hole; 2 Leads; 0.3 in Pin Spacing
S1 = SW DPDT: Switch; Published: 24-Mar-1999; LatestRevisionDate: 29-May-2009; LatestRevisionNote: IPC-7351 Footprint Added.; PackageVersion: Mar-2001; PackageReference: SOT23-6; Publisher: Altium Limited; PackageDescription: 6-Pin SOT-23 Package 0.95 mm Pitch, 2.7 mm Lead Span; Code_JEITA: SC-74; Code_IPC: SOT26A-6
S-D1 = Diode 1N4148: High Conductance Fast Diode; Published: 8-Jun-2000; LatestRevisionDate: 17-Jul-2002; LatestRevisionNote: Re-released for DXP Platform.; DatasheetVersion: 1997; PackageReference: DO-35; Publisher: Altium Limited; PackageDescription: Diode, Axial; Body 3.8 x 1.9 mm (LxDia. max), Lead Dia. 0.53 mm (max); Code_JEDEC: DO-204-AH; ComponentLink1Description: Manufacturer Link; ComponentLink1URL: http://www.fairchildsemi.com/; ComponentLink2Description: Datasheet; ComponentLink2URL: http://www.fairchildsemi.com/ds/1N%2F1N4148.pdf
S-Q1 = JFET-P: P-Channel JFET; Published: 8-Jun-2000; LatestRevisionDate: 17-Jul-2002; LatestRevisionNote: Re-released for DXP Platform.; PackageReference: TO-18A; Publisher: Altium Limited; PackageDescription: SC-89; 3 Flat Leads; Body 1.6 x 1.6 x 0.7 mm, inc leads (LxWxH typ)
SJ3 = SJ: SMD solder JUMPER
X5 = SMD-CRYSTAL-16MHZ-9PF-10PPM-60R(4P-3.2X2.5MM): as X4 on sheet ArduinoLeonard; Package: 1210 Epson; Price: 0.38 USD; Availability: Bad; Value: *

## Nets that join several sheets
GND: Audio_Actual (14 pins), ArduinoLeonard (33 pins), PowerBoost_Adafruit_based (25 pins), USBHUB (20 pins)
Net5V_2: Audio_Actual (10 pins), ArduinoLeonard (Bost-At.1), PowerBoost_Adafruit_based (7 pins)
NetR12_2: PowerBoost_Adafruit_based (R12.2 TSP.11), USBHUB (S1.1)
NetS-R2_1: PowerBoost_Adafruit_based (T1.1 TSP.12), USBHUB (S-R2.1)
USB1_N: ArduinoLeonard (R1.1), USBHUB (HUB.10 USB_1.2)
USB1_P: ArduinoLeonard (R2.1), USBHUB (HUB.11 USB_1.3)